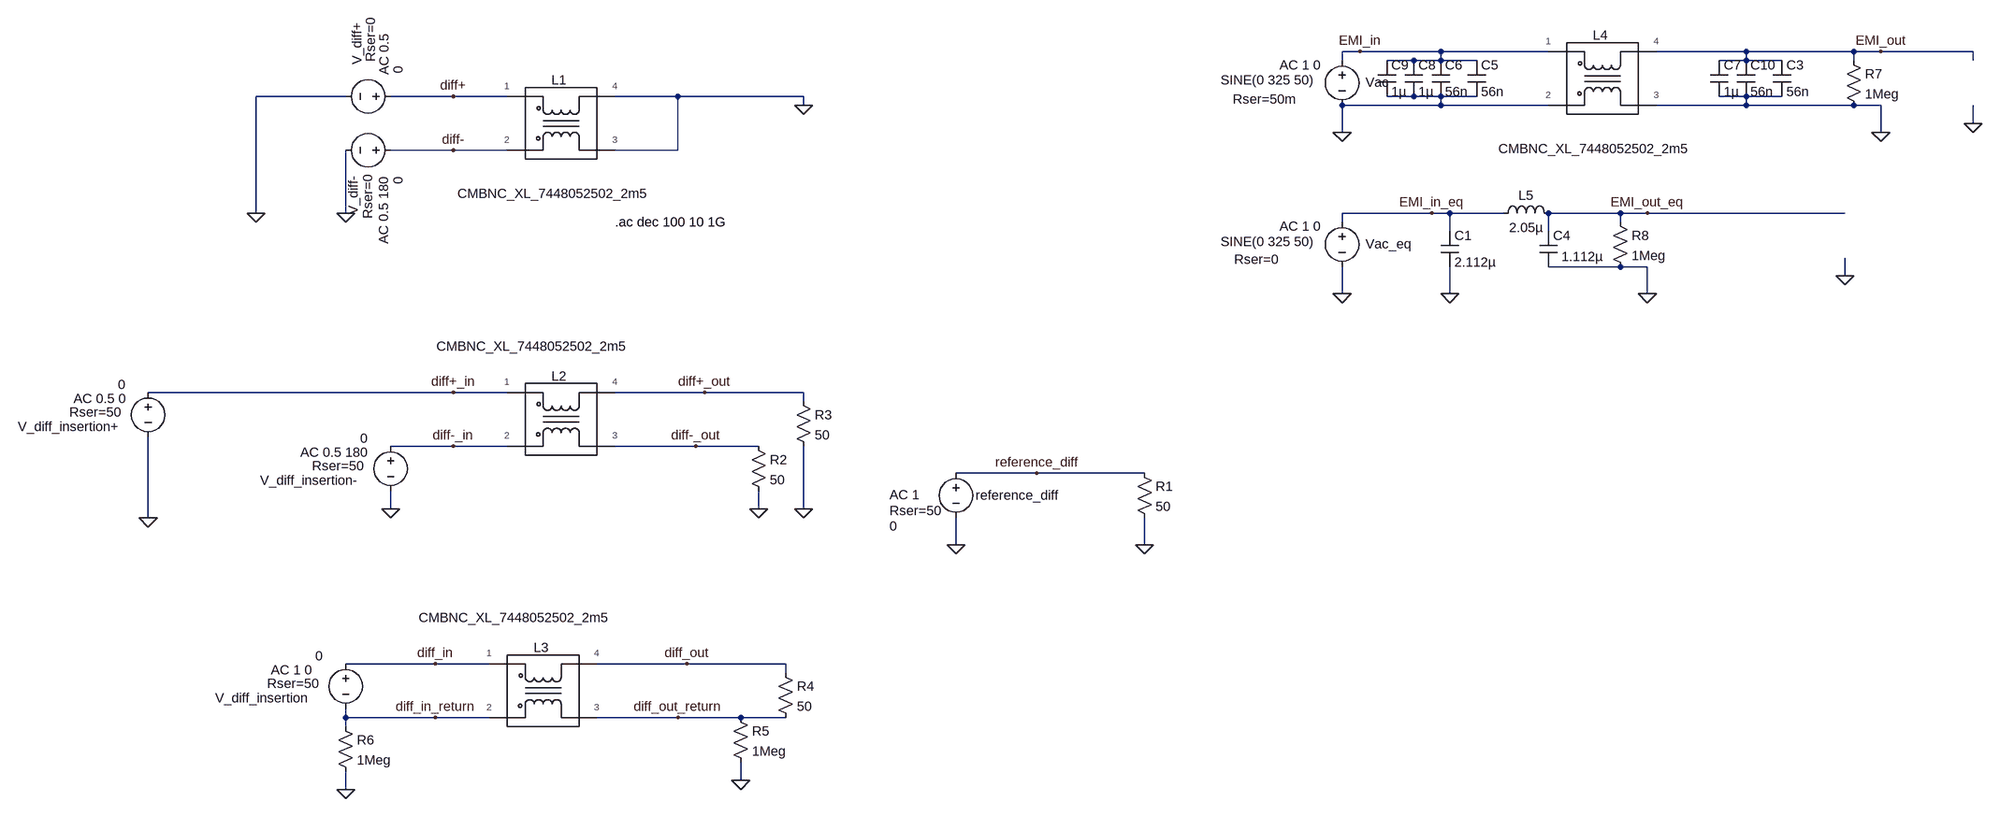
[diagram p0: schematic CM_validation.asc]
CM_validation.asc, the LTspice schematic file:
Version 4.1
SHEET 1 2936 1124
WIRE 1632 -384 1600 -384
WIRE 1776 -384 1632 -384
WIRE 1968 -384 1776 -384
WIRE 2320 -384 2160 -384
WIRE 2512 -384 2320 -384
WIRE 2560 -384 2512 -384
WIRE 2848 -384 2560 -384
WIRE 1600 -368 1600 -384
WIRE 1728 -368 1680 -368
WIRE 1776 -368 1776 -384
WIRE 1776 -368 1728 -368
WIRE 1840 -368 1776 -368
WIRE 2320 -368 2320 -384
WIRE 2320 -368 2272 -368
WIRE 2384 -368 2320 -368
WIRE 2512 -368 2512 -384
WIRE 2848 -368 2848 -384
WIRE -224 -304 -384 -304
WIRE -32 -304 -144 -304
WIRE 64 -304 -32 -304
WIRE 368 -304 256 -304
WIRE 592 -304 368 -304
WIRE 1728 -304 1680 -304
WIRE 1776 -304 1728 -304
WIRE 1840 -304 1776 -304
WIRE 2320 -304 2272 -304
WIRE 2384 -304 2320 -304
WIRE 592 -288 592 -304
WIRE 1776 -288 1776 -304
WIRE 1776 -288 1600 -288
WIRE 1968 -288 1776 -288
WIRE 2320 -288 2320 -304
WIRE 2320 -288 2160 -288
WIRE 2512 -288 2320 -288
WIRE 2560 -288 2512 -288
WIRE 2848 -256 2848 -288
WIRE 1600 -240 1600 -288
WIRE 2560 -240 2560 -288
WIRE -32 -208 -144 -208
WIRE 64 -208 -32 -208
WIRE 368 -208 368 -304
WIRE 368 -208 256 -208
WIRE -384 -96 -384 -304
WIRE -224 -96 -224 -208
WIRE 1760 -96 1600 -96
WIRE 1792 -96 1760 -96
WIRE 1888 -96 1792 -96
WIRE 2096 -96 1968 -96
WIRE 2144 -96 2096 -96
WIRE 2496 -96 2144 -96
WIRE 1600 -80 1600 -96
WIRE 2096 -80 2096 -96
WIRE 1792 -64 1792 -96
WIRE 1968 -64 1968 -96
WIRE 2096 0 1968 0
WIRE 2144 0 2096 0
WIRE 2496 16 2496 -16
WIRE 1600 48 1600 0
WIRE 1792 48 1792 0
WIRE 2144 48 2144 0
WIRE -32 224 -576 224
WIRE 64 224 -32 224
WIRE 416 224 256 224
WIRE 592 224 416 224
WIRE 592 240 592 224
WIRE -32 320 -144 320
WIRE 64 320 -32 320
WIRE 400 320 256 320
WIRE 512 320 400 320
WIRE 1056 368 912 368
WIRE 1248 368 1056 368
WIRE -144 432 -144 400
WIRE 512 432 512 400
WIRE 592 432 592 320
WIRE -576 448 -576 304
WIRE 912 496 912 448
WIRE 1248 496 1248 448
WIRE -64 880 -224 880
WIRE 32 880 -64 880
WIRE 384 880 224 880
WIRE 560 880 384 880
WIRE 560 896 560 880
WIRE -224 976 -224 960
WIRE -64 976 -224 976
WIRE 32 976 -64 976
WIRE 368 976 224 976
WIRE 480 976 368 976
WIRE 560 976 480 976
WIRE -224 992 -224 976
WIRE 480 1088 480 1056
WIRE -224 1104 -224 1072
FLAG -224 -96 0
FLAG 912 496 0
FLAG 1248 496 0
FLAG 1056 368 reference_diff
FLAG -32 -304 diff+
FLAG -32 -208 diff-
FLAG -384 -96 0
FLAG 592 -288 0
FLAG -32 224 diff+_in
FLAG -32 320 diff-_in
FLAG -144 432 0
FLAG 592 432 0
FLAG 416 224 diff+_out
FLAG 400 320 diff-_out
FLAG 512 432 0
FLAG -576 448 0
FLAG -64 880 diff_in
FLAG -64 976 diff_in_return
FLAG 384 880 diff_out
FLAG 368 976 diff_out_return
FLAG 480 1088 0
FLAG -224 1104 0
FLAG 2560 -240 0
FLAG 2560 -384 EMI_out
FLAG 1632 -384 EMI_in
FLAG 1600 -240 0
FLAG 2144 48 0
FLAG 2144 -96 EMI_out_eq
FLAG 1760 -96 EMI_in_eq
FLAG 1600 48 0
FLAG 1792 48 0
FLAG 2496 16 0
FLAG 2848 -256 0
SYMBOL voltage -128 -304 R90
WINDOW 123 -112 27 Left 2
WINDOW 39 -140 51 Left 2
WINDOW 0 -132 75 Left 2
WINDOW 3 -54 2 Left 2
SYMATTR Value2 AC 0.5
SYMATTR SpiceLine Rser=0
SYMATTR InstName V_diff+
SYMATTR Value 0
SYMBOL voltage 912 352 R0
WINDOW 123 -118 55 Left 2
WINDOW 39 -118 83 Left 2
WINDOW 0 35 56 Left 2
WINDOW 3 -118 111 Left 2
SYMATTR Value2 AC 1
SYMATTR SpiceLine Rser=50
SYMATTR InstName reference_diff
SYMATTR Value 0
SYMBOL res 1232 352 R0
SYMATTR InstName R1
SYMATTR Value 50
SYMBOL voltage -128 -208 R90
WINDOW 123 47 28 Left 2
WINDOW 39 44 56 Left 2
WINDOW 0 46 82 Left 2
WINDOW 3 47 2 Left 2
SYMATTR Value2 AC 0.5 180
SYMATTR SpiceLine Rser=0
SYMATTR InstName V_diff-
SYMATTR Value 0
SYMBOL WE-CMBNC 160 -256 R0
WINDOW 38 -185 125 Left 2
SYMATTR InstName L1
SYMBOL voltage -576 208 R0
WINDOW 123 -133 27 Left 2
WINDOW 39 -140 51 Left 2
WINDOW 0 -232 77 Left 2
WINDOW 3 -54 2 Left 2
SYMATTR Value2 AC 0.5 0
SYMATTR SpiceLine Rser=50
SYMATTR InstName V_diff_insertion+
SYMATTR Value 0
SYMBOL WE-CMBNC 160 272 R0
WINDOW 38 -222 -130 Left 2
SYMATTR InstName L2
SYMBOL res 576 224 R0
SYMATTR InstName R3
SYMATTR Value 50
SYMBOL res 496 304 R0
SYMATTR InstName R2
SYMATTR Value 50
SYMBOL voltage -144 304 R0
WINDOW 123 -161 27 Left 2
WINDOW 39 -140 51 Left 2
WINDOW 0 -232 77 Left 2
WINDOW 3 -54 2 Left 2
SYMATTR Value2 AC 0.5 180
SYMATTR SpiceLine Rser=50
SYMATTR InstName V_diff_insertion-
SYMATTR Value 0
SYMBOL voltage -224 864 R0
WINDOW 123 -133 27 Left 2
WINDOW 39 -140 51 Left 2
WINDOW 0 -232 77 Left 2
WINDOW 3 -54 2 Left 2
SYMATTR Value2 AC 1 0
SYMATTR SpiceLine Rser=50
SYMATTR InstName V_diff_insertion
SYMATTR Value 0
SYMBOL WE-CMBNC 128 928 R0
WINDOW 38 -222 -130 Left 2
SYMATTR InstName L3
SYMBOL res 544 880 R0
SYMATTR InstName R4
SYMATTR Value 50
SYMBOL res 464 960 R0
SYMATTR InstName R5
SYMATTR Value 1Meg
SYMBOL res -240 976 R0
SYMATTR InstName R6
SYMATTR Value 1Meg
SYMBOL WE-CMBNC 2064 -336 R0
WINDOW 38 -185 125 Left 2
SYMATTR InstName L4
SYMBOL voltage 1600 -384 R0
WINDOW 0 42 55 Left 2
WINDOW 3 -216 51 Left 2
WINDOW 123 -111 24 Left 2
WINDOW 39 -195 85 Left 2
SYMATTR InstName Vac
SYMATTR Value SINE(0 325 50)
SYMATTR Value2 AC 1 0
SYMATTR SpiceLine Rser=50m
SYMBOL res 2496 -384 R0
SYMATTR InstName R7
SYMATTR Value 1Meg
SYMBOL cap 1952 -64 R0
WINDOW 3 39 46 Left 2
SYMATTR Value 1.112µ
SYMATTR InstName C4
SYMATTR SpiceLine Rser=0.0495
SYMBOL voltage 1600 -96 R0
WINDOW 0 42 55 Left 2
WINDOW 3 -216 51 Left 2
WINDOW 123 -111 24 Left 2
WINDOW 39 -192 83 Left 2
SYMATTR InstName Vac_eq
SYMATTR Value SINE(0 325 50)
SYMATTR Value2 AC 1 0
SYMATTR SpiceLine Rser=0
SYMBOL res 2080 -96 R0
SYMATTR InstName R8
SYMATTR Value 1Meg
SYMBOL ind 1872 -80 R270
WINDOW 0 32 56 VTop 2
WINDOW 3 5 56 VBottom 2
SYMATTR InstName L5
SYMATTR Value 2.05µ
SYMATTR SpiceLine Rser=1.8m
SYMBOL cap 1760 -368 R0
SYMATTR InstName C6
SYMATTR Value 56n
SYMATTR SpiceLine Rser=1
SYMBOL cap 2256 -368 R0
SYMATTR InstName C7
SYMATTR Value 1µ
SYMATTR SpiceLine Rser=0.05
SYMBOL cap 1712 -368 R0
SYMATTR InstName C8
SYMATTR Value 1µ
SYMATTR SpiceLine Rser=0.05
SYMBOL cap 2368 -368 R0
SYMATTR InstName C3
SYMATTR Value 56n
SYMATTR SpiceLine Rser=1
SYMBOL cap 1824 -368 R0
SYMATTR InstName C5
SYMATTR Value 56n
SYMATTR SpiceLine Rser=1
SYMBOL cap 1664 -368 R0
SYMATTR InstName C9
SYMATTR Value 1µ
SYMATTR SpiceLine Rser=0.05
SYMBOL cap 2304 -368 R0
SYMATTR InstName C10
SYMATTR Value 56n
SYMATTR SpiceLine Rser=1
SYMBOL cap 1776 -64 R0
SYMATTR InstName C1
SYMATTR Value 2.112µ
SYMATTR SpiceLine Rser=0.025
TEXT 256 -80 Left 2 !.ac dec 100 10 1G

The netlist it stands for:
* CM_validation.asc
V_diff+ diff+ 0 0 AC 0.5 Rser=0
V§reference_diff reference_diff 0 0 AC 1 Rser=50
R1 reference_diff 0 50
V_diff- diff- 0 0 AC 0.5 180 Rser=0
X§L1 diff+ diff- 0 0 CMBNC_XL_7448052502_2m5  ; pins 1 2 3 4
V_diff_insertion+ diff+_in 0 0 AC 0.5 0 Rser=50
X§L2 diff+_in diff-_in diff-_out diff+_out CMBNC_XL_7448052502_2m5  ; pins 1 2 3 4
R3 diff+_out 0 50
R2 diff-_out 0 50
V_diff_insertion- diff-_in 0 0 AC 0.5 180 Rser=50
V_diff_insertion diff_in diff_in_return 0 AC 1 0 Rser=50
X§L3 diff_in diff_in_return diff_out_return diff_out CMBNC_XL_7448052502_2m5  ; pins 1 2 3 4
R4 diff_out diff_out_return 50
R5 diff_out_return 0 1Meg
R6 diff_in_return 0 1Meg
X§L4 EMI_in 0 0 EMI_out CMBNC_XL_7448052502_2m5  ; pins 1 2 3 4
Vac EMI_in 0 SINE(0 325 50) AC 1 0 Rser=50m
R7 EMI_out 0 1Meg
C4 EMI_out_eq 0 1.112µ Rser=0.0495
Vac_eq EMI_in_eq 0 SINE(0 325 50) AC 1 0 Rser=0
R8 EMI_out_eq 0 1Meg
L5 EMI_in_eq EMI_out_eq 2.05µ Rser=1.8m
C6 EMI_in 0 56n Rser=1
C7 EMI_out 0 1µ Rser=0.05
C8 EMI_in 0 1µ Rser=0.05
C3 EMI_out 0 56n Rser=1
C5 EMI_in 0 56n Rser=1
C9 EMI_in 0 1µ Rser=0.05
C10 EMI_out 0 56n Rser=1
C1 EMI_in_eq 0 2.112µ Rser=0.025
.ac dec 100 10 1G
.lib WE-CMBNC.lib
.backanno
.end